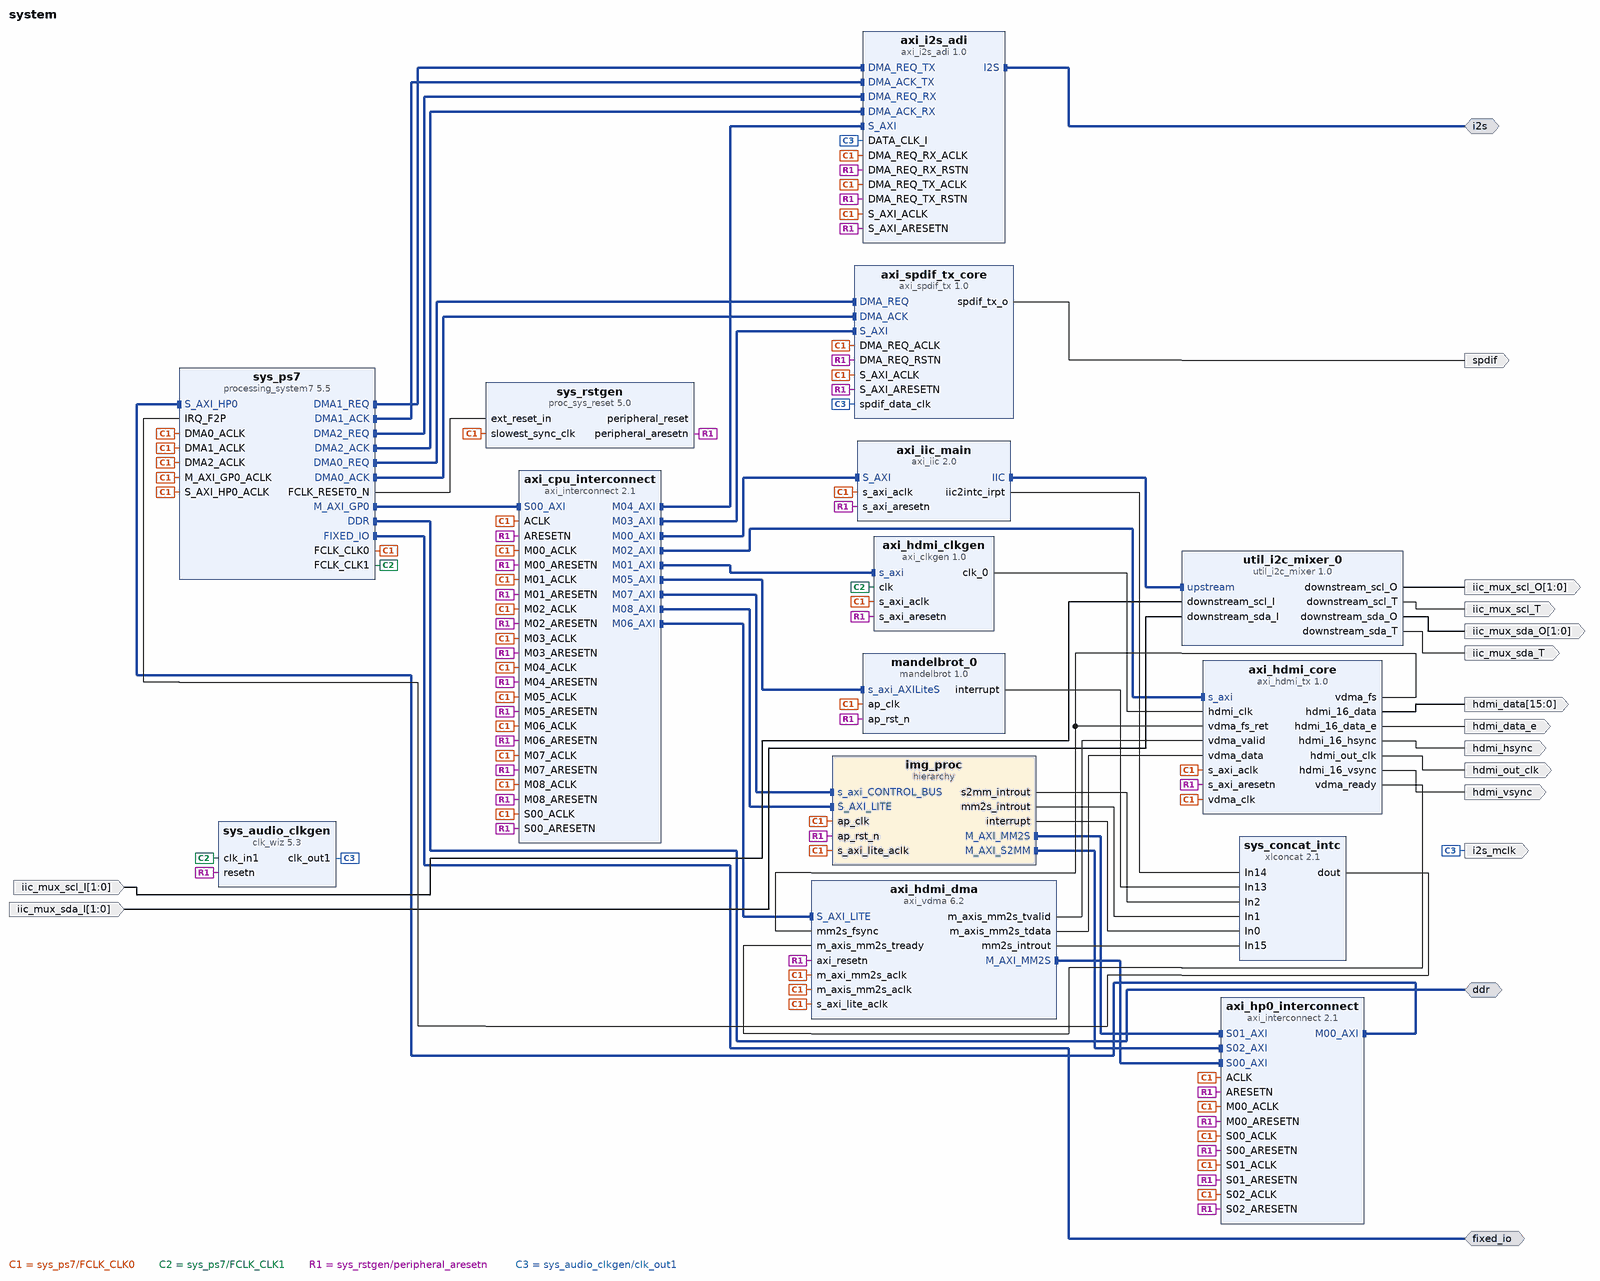
[diagram p0: block diagram of the top level]
# Vivado block design system, xc7z020clg484-1, Vivado 2016.3
create_bd_design system

create_bd_intf_port -mode Master -vlnv xilinx.com:interface:ddrx_rtl:1.0 ddr
create_bd_intf_port -mode Master -vlnv xilinx.com:display_processing_system7:fixedio_rtl:1.0 fixed_io
create_bd_intf_port -mode Master -vlnv analog.com:interface:i2s_rtl:1.0 i2s
create_bd_port -dir O hdmi_out_clk
create_bd_port -dir O hdmi_hsync
create_bd_port -dir O hdmi_vsync
create_bd_port -dir O hdmi_data_e
create_bd_port -dir O -from 15 -to 0 hdmi_data
create_bd_port -dir O -type clk i2s_mclk
create_bd_port -dir O spdif
create_bd_port -dir O iic_mux_scl_T
create_bd_port -dir O -from 1 -to 0 iic_mux_scl_O
create_bd_port -dir O iic_mux_sda_T
create_bd_port -dir O -from 1 -to 0 iic_mux_sda_O
create_bd_port -dir I -from 1 -to 0 iic_mux_scl_I
create_bd_port -dir I -from 1 -to 0 iic_mux_sda_I

create_bd_cell -type ip -vlnv xilinx.com:ip:processing_system7:5.5 sys_ps7
set_property -dict [list \
  CONFIG.PCW_FPGA0_PERIPHERAL_FREQMHZ 100.0 \
  CONFIG.PCW_FPGA1_PERIPHERAL_FREQMHZ 200.0 \
  CONFIG.PCW_USE_S_AXI_HP0 1 \
  CONFIG.PCW_USE_DMA0 1 \
  CONFIG.PCW_USE_DMA1 1 \
  CONFIG.PCW_USE_DMA2 1 \
  CONFIG.PCW_USE_FABRIC_INTERRUPT 1 \
  CONFIG.PCW_EN_CLK1_PORT 1 \
  CONFIG.PCW_EN_RST1_PORT 1 \
  CONFIG.PCW_IRQ_F2P_INTR 1 \
  CONFIG.PCW_IRQ_F2P_MODE REVERSE \
  CONFIG.PCW_IMPORT_BOARD_PRESET ZedBoard \
  CONFIG.PCW_SPI0_PERIPHERAL_ENABLE 1 \
  CONFIG.PCW_SPI0_SPI0_IO EMIO \
  CONFIG.PCW_SPI1_PERIPHERAL_ENABLE 1 \
  CONFIG.PCW_SPI1_SPI1_IO EMIO \
  CONFIG.PCW_GPIO_EMIO_GPIO_ENABLE 1 \
  CONFIG.PCW_GPIO_EMIO_GPIO_IO 64 \
] [get_bd_cells sys_ps7]
# 1 more settings of sys_ps7 are not shown: defaults, MIO pin electricals, DDR timing, and values the tool derives
create_bd_cell -type ip -vlnv xilinx.com:ip:axi_iic:2.0 axi_iic_main
set_property -dict {CONFIG.USE_BOARD_FLOW true CONFIG.IIC_BOARD_INTERFACE Custom} [get_bd_cells axi_iic_main]
create_bd_cell -type ip -vlnv xilinx.com:ip:xlconcat:2.1 sys_concat_intc
set_property -dict {CONFIG.NUM_PORTS 16} [get_bd_cells sys_concat_intc]
create_bd_cell -type ip -vlnv xilinx.com:ip:proc_sys_reset:5.0 sys_rstgen
set_property -dict {CONFIG.C_EXT_RST_WIDTH 1} [get_bd_cells sys_rstgen]
create_bd_cell -type ip -vlnv analog.com:user:axi_clkgen:1.0 axi_hdmi_clkgen
create_bd_cell -type ip -vlnv analog.com:user:axi_hdmi_tx:1.0 axi_hdmi_core
create_bd_cell -type ip -vlnv xilinx.com:ip:axi_vdma:6.2 axi_hdmi_dma
set_property -dict [list \
  CONFIG.c_m_axis_mm2s_tdata_width 64 \
  CONFIG.c_use_mm2s_fsync 1 \
  CONFIG.c_include_s2mm 0 \
] [get_bd_cells axi_hdmi_dma]
create_bd_cell -type ip -vlnv xilinx.com:ip:clk_wiz:5.3 sys_audio_clkgen
set_property -dict [list \
  CONFIG.PRIM_IN_FREQ 200.000 \
  CONFIG.CLKOUT1_REQUESTED_OUT_FREQ 12.288 \
  CONFIG.USE_LOCKED false \
  CONFIG.USE_RESET true \
  CONFIG.RESET_TYPE ACTIVE_LOW \
] [get_bd_cells sys_audio_clkgen]
create_bd_cell -type ip -vlnv analog.com:user:axi_spdif_tx:1.0 axi_spdif_tx_core
set_property -dict {CONFIG.S_AXI_ADDRESS_WIDTH 16 CONFIG.DMA_TYPE 1} [get_bd_cells axi_spdif_tx_core]
create_bd_cell -type ip -vlnv analog.com:user:axi_i2s_adi:1.0 axi_i2s_adi
set_property -dict {CONFIG.S_AXI_ADDRESS_WIDTH 16 CONFIG.DMA_TYPE 1} [get_bd_cells axi_i2s_adi]
create_bd_cell -type ip -vlnv xilinx.com:ip:axi_interconnect:2.1 axi_cpu_interconnect
set_property -dict {CONFIG.NUM_MI 9} [get_bd_cells axi_cpu_interconnect]
create_bd_cell -type ip -vlnv xilinx.com:ip:axi_interconnect:2.1 axi_hp0_interconnect
set_property -dict {CONFIG.NUM_SI 3 CONFIG.NUM_MI 1} [get_bd_cells axi_hp0_interconnect]
create_bd_cell -type ip -vlnv analog.com:user:util_i2c_mixer:1.0 util_i2c_mixer_0
create_bd_cell -type ip -vlnv rp:hls:mandelbrot:1.0 mandelbrot_0
create_bd_cell -type hier img_proc

# ---- hierarchy /img_proc ----
current_bd_instance /img_proc
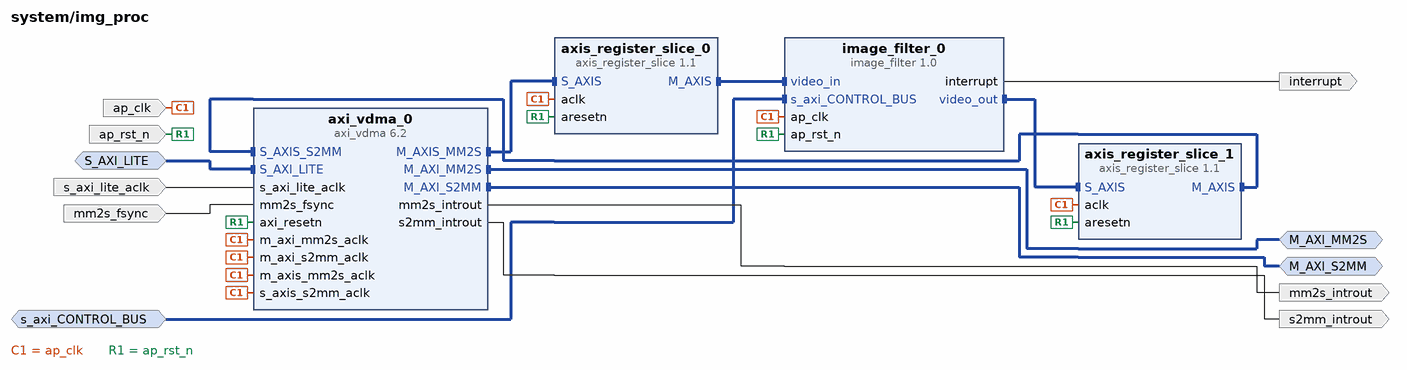
[diagram p1: block diagram inside /img_proc]
create_bd_intf_pin -mode Master -vlnv xilinx.com:interface:aximm_rtl:1.0 M_AXI_MM2S
create_bd_intf_pin -mode Master -vlnv xilinx.com:interface:aximm_rtl:1.0 M_AXI_S2MM
create_bd_intf_pin -mode Slave -vlnv xilinx.com:interface:aximm_rtl:1.0 s_axi_CONTROL_BUS
create_bd_intf_pin -mode Slave -vlnv xilinx.com:interface:aximm_rtl:1.0 S_AXI_LITE
create_bd_pin -dir I -type clk ap_clk
create_bd_pin -dir I -type rst ap_rst_n
create_bd_pin -dir O -type intr interrupt
create_bd_pin -dir O -type intr mm2s_introut
create_bd_pin -dir O -type intr s2mm_introut
create_bd_pin -dir I -type clk s_axi_lite_aclk
create_bd_pin -dir I mm2s_fsync

create_bd_cell -type ip -vlnv rp:hls:image_filter:1.0 image_filter_0
create_bd_cell -type ip -vlnv xilinx.com:ip:axis_register_slice:1.1 axis_register_slice_0
set_property -dict {CONFIG.TDATA_NUM_BYTES 2} [get_bd_cells axis_register_slice_0]
create_bd_cell -type ip -vlnv xilinx.com:ip:axis_register_slice:1.1 axis_register_slice_1
create_bd_cell -type ip -vlnv xilinx.com:ip:axi_vdma:6.2 axi_vdma_0
set_property -dict [list \
  CONFIG.c_m_axi_mm2s_data_width 32 \
  CONFIG.c_m_axis_mm2s_tdata_width 16 \
  CONFIG.c_m_axi_s2mm_data_width 32 \
  CONFIG.c_num_fstores 1 \
  CONFIG.c_use_mm2s_fsync 1 \
  CONFIG.c_mm2s_linebuffer_depth 4096 \
  CONFIG.c_s2mm_linebuffer_depth 4096 \
  CONFIG.c_mm2s_max_burst_length 16 \
  CONFIG.c_s2mm_max_burst_length 16 \
] [get_bd_cells axi_vdma_0]

# ---- connections ----

current_bd_instance /img_proc
connect_bd_intf_net [get_bd_intf_pins image_filter_0/video_in] [get_bd_intf_pins axis_register_slice_0/M_AXIS]
connect_bd_intf_net [get_bd_intf_pins axi_vdma_0/S_AXIS_S2MM] [get_bd_intf_pins axis_register_slice_1/M_AXIS]
connect_bd_intf_net [get_bd_intf_pins image_filter_0/video_out] [get_bd_intf_pins axis_register_slice_1/S_AXIS]
connect_bd_intf_net [get_bd_intf_pins axi_vdma_0/M_AXIS_MM2S] [get_bd_intf_pins axis_register_slice_0/S_AXIS]
connect_bd_intf_net [get_bd_intf_pins M_AXI_MM2S] [get_bd_intf_pins axi_vdma_0/M_AXI_MM2S]
connect_bd_intf_net [get_bd_intf_pins M_AXI_S2MM] [get_bd_intf_pins axi_vdma_0/M_AXI_S2MM]
connect_bd_intf_net [get_bd_intf_pins s_axi_CONTROL_BUS] [get_bd_intf_pins image_filter_0/s_axi_CONTROL_BUS]
connect_bd_intf_net [get_bd_intf_pins S_AXI_LITE] [get_bd_intf_pins axi_vdma_0/S_AXI_LITE]
connect_bd_net [get_bd_pins ap_clk] \
  [get_bd_pins image_filter_0/ap_clk] [get_bd_pins axi_vdma_0/m_axi_mm2s_aclk] [get_bd_pins axi_vdma_0/m_axi_s2mm_aclk] \
  [get_bd_pins axi_vdma_0/s_axis_s2mm_aclk] [get_bd_pins axi_vdma_0/m_axis_mm2s_aclk] \
  [get_bd_pins axis_register_slice_0/aclk] [get_bd_pins axis_register_slice_1/aclk]
connect_bd_net [get_bd_pins ap_rst_n] \
  [get_bd_pins image_filter_0/ap_rst_n] [get_bd_pins axi_vdma_0/axi_resetn] [get_bd_pins axis_register_slice_1/aresetn] \
  [get_bd_pins axis_register_slice_0/aresetn]
connect_bd_net [get_bd_pins image_filter_0/interrupt] [get_bd_pins interrupt]
connect_bd_net [get_bd_pins axi_vdma_0/mm2s_introut] [get_bd_pins mm2s_introut]
connect_bd_net [get_bd_pins axi_vdma_0/s2mm_introut] [get_bd_pins s2mm_introut]
connect_bd_net [get_bd_pins s_axi_lite_aclk] [get_bd_pins axi_vdma_0/s_axi_lite_aclk]
connect_bd_net [get_bd_pins mm2s_fsync] [get_bd_pins axi_vdma_0/mm2s_fsync]

current_bd_instance /
connect_bd_intf_net [get_bd_intf_pins sys_ps7/DMA0_REQ] [get_bd_intf_pins axi_spdif_tx_core/DMA_REQ]
connect_bd_intf_net [get_bd_intf_pins sys_ps7/DMA0_ACK] [get_bd_intf_pins axi_spdif_tx_core/DMA_ACK]
connect_bd_intf_net [get_bd_intf_pins sys_ps7/DMA1_REQ] [get_bd_intf_pins axi_i2s_adi/DMA_REQ_TX]
connect_bd_intf_net [get_bd_intf_pins sys_ps7/DMA1_ACK] [get_bd_intf_pins axi_i2s_adi/DMA_ACK_TX]
connect_bd_intf_net [get_bd_intf_pins sys_ps7/DMA2_REQ] [get_bd_intf_pins axi_i2s_adi/DMA_REQ_RX]
connect_bd_intf_net [get_bd_intf_pins sys_ps7/DMA2_ACK] [get_bd_intf_pins axi_i2s_adi/DMA_ACK_RX]
connect_bd_intf_net [get_bd_intf_pins axi_cpu_interconnect/S00_AXI] [get_bd_intf_pins sys_ps7/M_AXI_GP0]
connect_bd_intf_net [get_bd_intf_pins axi_cpu_interconnect/M00_AXI] [get_bd_intf_pins axi_iic_main/S_AXI]
connect_bd_intf_net [get_bd_intf_pins axi_cpu_interconnect/M01_AXI] [get_bd_intf_pins axi_hdmi_clkgen/s_axi]
connect_bd_intf_net [get_bd_intf_pins axi_cpu_interconnect/M02_AXI] [get_bd_intf_pins axi_hdmi_core/s_axi]
connect_bd_intf_net [get_bd_intf_pins axi_cpu_interconnect/M03_AXI] [get_bd_intf_pins axi_spdif_tx_core/S_AXI]
connect_bd_intf_net [get_bd_intf_pins axi_cpu_interconnect/M04_AXI] [get_bd_intf_pins axi_i2s_adi/S_AXI]
connect_bd_intf_net [get_bd_intf_pins axi_hp0_interconnect/M00_AXI] [get_bd_intf_pins sys_ps7/S_AXI_HP0]
connect_bd_intf_net [get_bd_intf_pins axi_hp0_interconnect/S00_AXI] [get_bd_intf_pins axi_hdmi_dma/M_AXI_MM2S]
connect_bd_intf_net [get_bd_intf_pins axi_cpu_interconnect/M06_AXI] [get_bd_intf_pins axi_hdmi_dma/S_AXI_LITE]
connect_bd_intf_net [get_bd_intf_pins axi_iic_main/IIC] [get_bd_intf_pins util_i2c_mixer_0/upstream]
connect_bd_intf_net [get_bd_intf_pins axi_cpu_interconnect/M05_AXI] [get_bd_intf_pins mandelbrot_0/s_axi_AXILiteS]
connect_bd_intf_net [get_bd_intf_pins axi_hp0_interconnect/S01_AXI] [get_bd_intf_pins img_proc/M_AXI_MM2S]
connect_bd_intf_net [get_bd_intf_pins axi_hp0_interconnect/S02_AXI] [get_bd_intf_pins img_proc/M_AXI_S2MM]
connect_bd_intf_net [get_bd_intf_pins axi_cpu_interconnect/M07_AXI] [get_bd_intf_pins img_proc/s_axi_CONTROL_BUS]
connect_bd_intf_net [get_bd_intf_pins axi_cpu_interconnect/M08_AXI] [get_bd_intf_pins img_proc/S_AXI_LITE]
connect_bd_intf_net [get_bd_intf_ports ddr] [get_bd_intf_pins sys_ps7/DDR]
connect_bd_intf_net [get_bd_intf_ports fixed_io] [get_bd_intf_pins sys_ps7/FIXED_IO]
connect_bd_intf_net [get_bd_intf_ports i2s] [get_bd_intf_pins axi_i2s_adi/I2S]
connect_bd_net -net sys_cpu_clk [get_bd_pins sys_ps7/FCLK_CLK0] \
  [get_bd_pins sys_rstgen/slowest_sync_clk] [get_bd_pins axi_hdmi_core/vdma_clk] [get_bd_pins axi_hdmi_dma/m_axis_mm2s_aclk] \
  [get_bd_pins axi_spdif_tx_core/DMA_REQ_ACLK] [get_bd_pins sys_ps7/DMA0_ACLK] [get_bd_pins axi_i2s_adi/DMA_REQ_RX_ACLK] \
  [get_bd_pins axi_i2s_adi/DMA_REQ_TX_ACLK] [get_bd_pins sys_ps7/DMA1_ACLK] [get_bd_pins sys_ps7/DMA2_ACLK] \
  [get_bd_pins sys_ps7/M_AXI_GP0_ACLK] [get_bd_pins axi_iic_main/s_axi_aclk] [get_bd_pins axi_hdmi_clkgen/s_axi_aclk] \
  [get_bd_pins axi_hdmi_core/s_axi_aclk] [get_bd_pins axi_spdif_tx_core/S_AXI_ACLK] [get_bd_pins axi_i2s_adi/S_AXI_ACLK] \
  [get_bd_pins sys_ps7/S_AXI_HP0_ACLK] [get_bd_pins axi_hdmi_dma/m_axi_mm2s_aclk] [get_bd_pins axi_hdmi_dma/s_axi_lite_aclk] \
  [get_bd_pins mandelbrot_0/ap_clk] [get_bd_pins axi_cpu_interconnect/ACLK] [get_bd_pins axi_cpu_interconnect/S00_ACLK] \
  [get_bd_pins axi_cpu_interconnect/M00_ACLK] [get_bd_pins axi_cpu_interconnect/M01_ACLK] \
  [get_bd_pins axi_cpu_interconnect/M02_ACLK] [get_bd_pins axi_cpu_interconnect/M03_ACLK] \
  [get_bd_pins axi_cpu_interconnect/M04_ACLK] [get_bd_pins axi_cpu_interconnect/M05_ACLK] \
  [get_bd_pins axi_hp0_interconnect/ACLK] [get_bd_pins axi_hp0_interconnect/M00_ACLK] \
  [get_bd_pins axi_hp0_interconnect/S00_ACLK] [get_bd_pins axi_cpu_interconnect/M06_ACLK] \
  [get_bd_pins axi_cpu_interconnect/M07_ACLK] [get_bd_pins img_proc/ap_clk] [get_bd_pins axi_cpu_interconnect/M08_ACLK] \
  [get_bd_pins axi_hp0_interconnect/S01_ACLK] [get_bd_pins axi_hp0_interconnect/S02_ACLK] \
  [get_bd_pins img_proc/s_axi_lite_aclk]
connect_bd_net -net sys_200m_clk [get_bd_pins sys_ps7/FCLK_CLK1] [get_bd_pins axi_hdmi_clkgen/clk] [get_bd_pins sys_audio_clkgen/clk_in1]
# net sys_cpu_reset has one end: sys_rstgen/peripheral_reset
connect_bd_net -net sys_cpu_resetn [get_bd_pins sys_rstgen/peripheral_aresetn] \
  [get_bd_pins axi_spdif_tx_core/DMA_REQ_RSTN] [get_bd_pins sys_audio_clkgen/resetn] \
  [get_bd_pins axi_i2s_adi/DMA_REQ_TX_RSTN] [get_bd_pins axi_i2s_adi/DMA_REQ_RX_RSTN] \
  [get_bd_pins axi_iic_main/s_axi_aresetn] [get_bd_pins axi_hdmi_clkgen/s_axi_aresetn] \
  [get_bd_pins axi_hdmi_core/s_axi_aresetn] [get_bd_pins axi_spdif_tx_core/S_AXI_ARESETN] \
  [get_bd_pins axi_i2s_adi/S_AXI_ARESETN] [get_bd_pins axi_hdmi_dma/axi_resetn] [get_bd_pins mandelbrot_0/ap_rst_n] \
  [get_bd_pins axi_cpu_interconnect/ARESETN] [get_bd_pins axi_cpu_interconnect/S00_ARESETN] \
  [get_bd_pins axi_cpu_interconnect/M00_ARESETN] [get_bd_pins axi_cpu_interconnect/M01_ARESETN] \
  [get_bd_pins axi_cpu_interconnect/M02_ARESETN] [get_bd_pins axi_cpu_interconnect/M03_ARESETN] \
  [get_bd_pins axi_cpu_interconnect/M04_ARESETN] [get_bd_pins axi_cpu_interconnect/M05_ARESETN] \
  [get_bd_pins axi_hp0_interconnect/ARESETN] [get_bd_pins axi_hp0_interconnect/M00_ARESETN] \
  [get_bd_pins axi_hp0_interconnect/S00_ARESETN] [get_bd_pins axi_cpu_interconnect/M06_ARESETN] \
  [get_bd_pins axi_cpu_interconnect/M07_ARESETN] [get_bd_pins img_proc/ap_rst_n] \
  [get_bd_pins axi_cpu_interconnect/M08_ARESETN] [get_bd_pins axi_hp0_interconnect/S01_ARESETN] \
  [get_bd_pins axi_hp0_interconnect/S02_ARESETN]
connect_bd_net [get_bd_pins sys_ps7/FCLK_RESET0_N] [get_bd_pins sys_rstgen/ext_reset_in]
connect_bd_net [get_bd_pins axi_hdmi_clkgen/clk_0] [get_bd_pins axi_hdmi_core/hdmi_clk]
connect_bd_net [get_bd_pins axi_hdmi_core/hdmi_out_clk] [get_bd_ports hdmi_out_clk]
connect_bd_net [get_bd_pins axi_hdmi_core/hdmi_16_hsync] [get_bd_ports hdmi_hsync]
connect_bd_net [get_bd_pins axi_hdmi_core/hdmi_16_vsync] [get_bd_ports hdmi_vsync]
connect_bd_net [get_bd_pins axi_hdmi_core/hdmi_16_data_e] [get_bd_ports hdmi_data_e]
connect_bd_net [get_bd_pins axi_hdmi_core/hdmi_16_data] [get_bd_ports hdmi_data]
connect_bd_net [get_bd_pins axi_hdmi_dma/m_axis_mm2s_tvalid] [get_bd_pins axi_hdmi_core/vdma_valid]
connect_bd_net [get_bd_pins axi_hdmi_dma/m_axis_mm2s_tdata] [get_bd_pins axi_hdmi_core/vdma_data]
connect_bd_net [get_bd_pins axi_hdmi_core/vdma_ready] [get_bd_pins axi_hdmi_dma/m_axis_mm2s_tready]
connect_bd_net [get_bd_pins axi_hdmi_core/vdma_fs] [get_bd_pins axi_hdmi_dma/mm2s_fsync] [get_bd_pins axi_hdmi_core/vdma_fs_ret]
connect_bd_net [get_bd_pins sys_audio_clkgen/clk_out1] \
  [get_bd_ports i2s_mclk] [get_bd_pins axi_spdif_tx_core/spdif_data_clk] [get_bd_pins axi_i2s_adi/DATA_CLK_I]
connect_bd_net [get_bd_pins axi_spdif_tx_core/spdif_tx_o] [get_bd_ports spdif]
connect_bd_net [get_bd_pins sys_concat_intc/dout] [get_bd_pins sys_ps7/IRQ_F2P]
connect_bd_net [get_bd_pins util_i2c_mixer_0/downstream_scl_T] [get_bd_ports iic_mux_scl_T]
connect_bd_net [get_bd_pins util_i2c_mixer_0/downstream_scl_O] [get_bd_ports iic_mux_scl_O]
connect_bd_net [get_bd_pins util_i2c_mixer_0/downstream_sda_T] [get_bd_ports iic_mux_sda_T]
connect_bd_net [get_bd_pins util_i2c_mixer_0/downstream_sda_O] [get_bd_ports iic_mux_sda_O]
connect_bd_net -net downstream_scl_I_1 [get_bd_ports iic_mux_scl_I] [get_bd_pins util_i2c_mixer_0/downstream_scl_I]
connect_bd_net -net downstream_sda_I_1 [get_bd_ports iic_mux_sda_I] [get_bd_pins util_i2c_mixer_0/downstream_sda_I]
connect_bd_net [get_bd_pins axi_hdmi_dma/mm2s_introut] [get_bd_pins sys_concat_intc/In15]
connect_bd_net [get_bd_pins axi_iic_main/iic2intc_irpt] [get_bd_pins sys_concat_intc/In14]
connect_bd_net [get_bd_pins mandelbrot_0/interrupt] [get_bd_pins sys_concat_intc/In13]
connect_bd_net [get_bd_pins img_proc/s2mm_introut] [get_bd_pins sys_concat_intc/In2]
connect_bd_net [get_bd_pins img_proc/mm2s_introut] [get_bd_pins sys_concat_intc/In1]
connect_bd_net [get_bd_pins img_proc/interrupt] [get_bd_pins sys_concat_intc/In0]

# ---- address map ----
assign_bd_address -offset 0x00000000 -range 512M -target_address_space [get_bd_addr_spaces axi_hdmi_dma/Data_MM2S] [get_bd_addr_segs sys_ps7/S_AXI_HP0/HP0_DDR_LOWOCM]
assign_bd_address -offset 0x00000000 -range 512M -target_address_space [get_bd_addr_spaces img_proc/axi_vdma_0/Data_MM2S] [get_bd_addr_segs sys_ps7/S_AXI_HP0/HP0_DDR_LOWOCM]
assign_bd_address -offset 0x00000000 -range 512M -target_address_space [get_bd_addr_spaces img_proc/axi_vdma_0/Data_S2MM] [get_bd_addr_segs sys_ps7/S_AXI_HP0/HP0_DDR_LOWOCM]
assign_bd_address -offset 0x41600000 -range 4K -target_address_space [get_bd_addr_spaces sys_ps7/Data] [get_bd_addr_segs axi_iic_main/S_AXI/Reg]
assign_bd_address -offset 0x43000000 -range 64K -target_address_space [get_bd_addr_spaces sys_ps7/Data] [get_bd_addr_segs axi_hdmi_dma/S_AXI_LITE/Reg]
assign_bd_address -offset 0x43010000 -range 64K -target_address_space [get_bd_addr_spaces sys_ps7/Data] [get_bd_addr_segs img_proc/axi_vdma_0/S_AXI_LITE/Reg]
assign_bd_address -offset 0x43C00000 -range 64K -target_address_space [get_bd_addr_spaces sys_ps7/Data] [get_bd_addr_segs mandelbrot_0/s_axi_AXILiteS/Reg]
assign_bd_address -offset 0x43C10000 -range 64K -target_address_space [get_bd_addr_spaces sys_ps7/Data] [get_bd_addr_segs img_proc/image_filter_0/s_axi_CONTROL_BUS/Reg]
assign_bd_address -offset 0x70E00000 -range 64K -target_address_space [get_bd_addr_spaces sys_ps7/Data] [get_bd_addr_segs axi_hdmi_core/s_axi/axi_lite]
assign_bd_address -offset 0x75C00000 -range 64K -target_address_space [get_bd_addr_spaces sys_ps7/Data] [get_bd_addr_segs axi_spdif_tx_core/S_AXI/reg0]
assign_bd_address -offset 0x77600000 -range 64K -target_address_space [get_bd_addr_spaces sys_ps7/Data] [get_bd_addr_segs axi_i2s_adi/S_AXI/reg0]
assign_bd_address -offset 0x79000000 -range 64K -target_address_space [get_bd_addr_spaces sys_ps7/Data] [get_bd_addr_segs axi_hdmi_clkgen/s_axi/axi_lite]

validate_bd_design
save_bd_design
